# EAGLE design untitled (EAGLE 9.6.2)
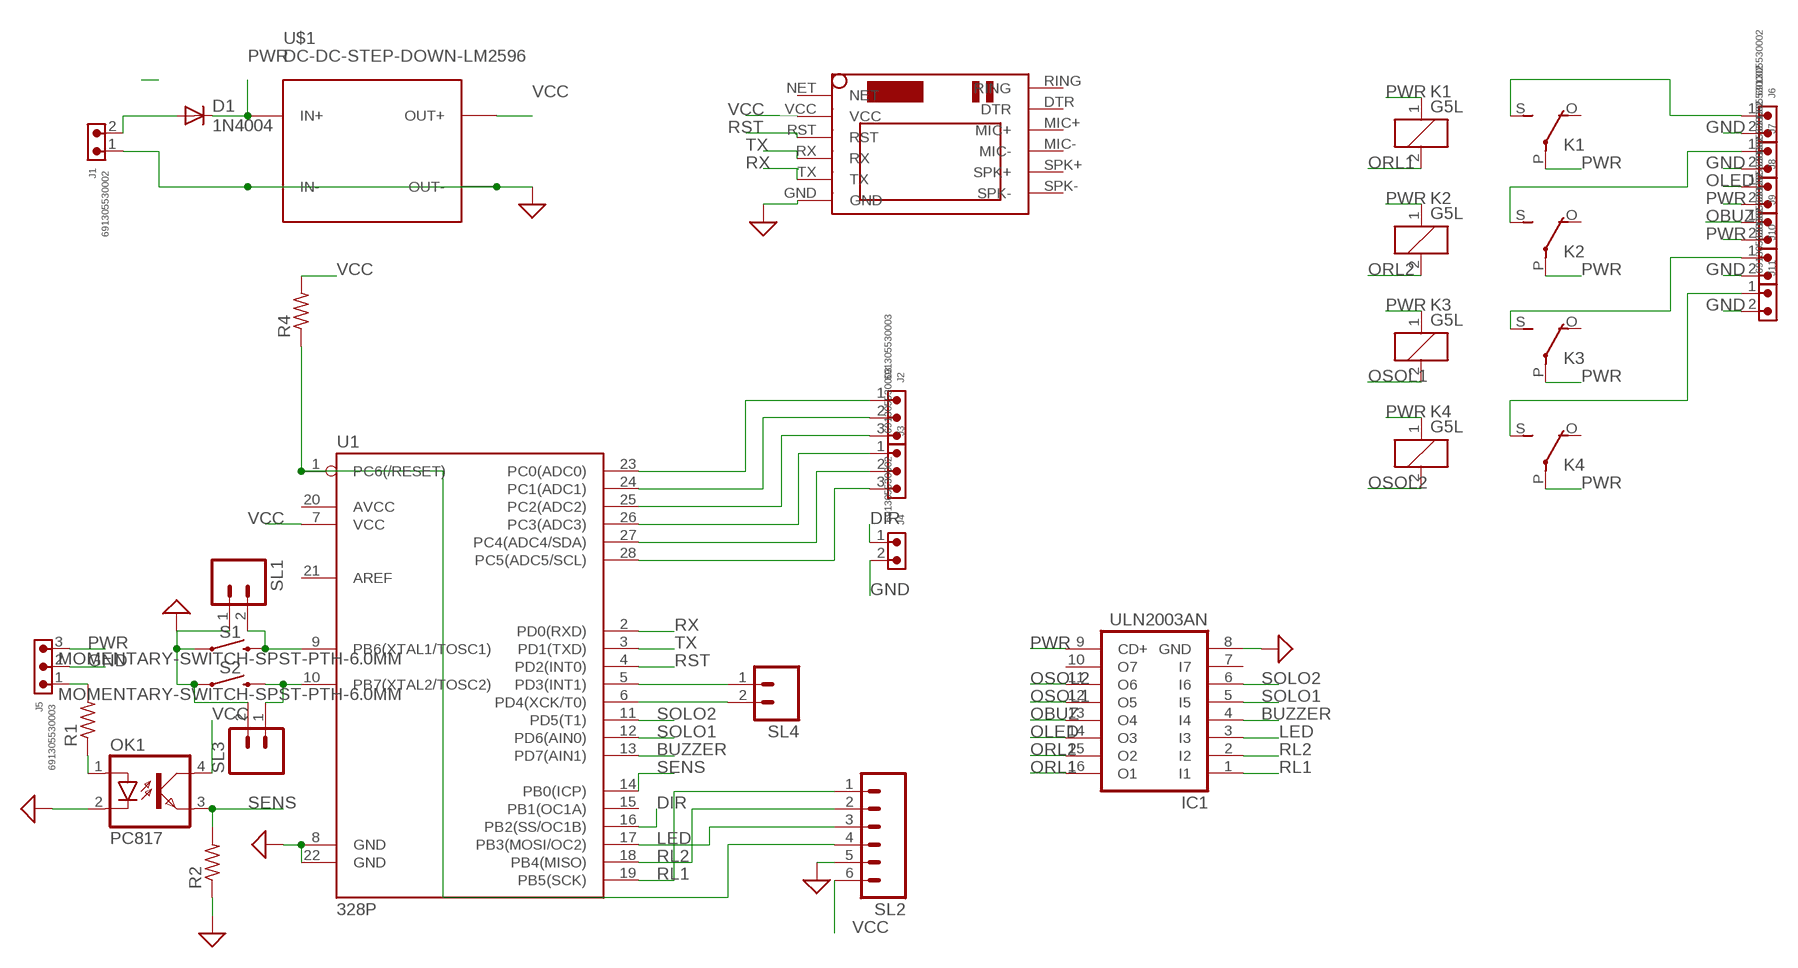
[diagram p0: schematic, sheet 1]

## Parts
D1  1N4004  [DO41-10]
IC1  ULN2003AN  [DIL16]
J1  691305530002  691305530002  [691305530002]
J2  691305530003  691305530003  [691305530003]
J3  691305530003  691305530003  [691305530003]
J4  691305530002  691305530002  [691305530002]
J5  691305530003  691305530003  [691305530003]
J6  691305530002  691305530002  [691305530002]
J7  691305530002  691305530002  [691305530002]
J8  691305530002  691305530002  [691305530002]
J9  691305530002  691305530002  [691305530002]
J10  691305530002  691305530002  [691305530002]
J11  691305530002  691305530002  [691305530002]
K1  G5L  [G5LE]
K2  G5L  [G5LE]
K3  G5L  [G5LE]
K4  G5L  [G5LE]
OK1  PC817  [DIL04]
R1  R-US_0207/10  [0207/10]
R2  R-US_0207/10  [0207/10]
R4  R-US_0207/10  [0207/10]
S1  MOMENTARY-SWITCH-SPST-PTH-6.0MM  [TACTILE_SWITCH_PTH_6.0MM]
S2  MOMENTARY-SWITCH-SPST-PTH-6.0MM  [TACTILE_SWITCH_PTH_6.0MM]
SL1  M02  [02P]
SL2  M06  [06P]
SL3  M02  [02P]
SL4  M02  [02P]
U1  328P  ATMEGA328P_PDIP  [DIP28]
U$1  DC-DC-STEP-DOWN-LM2596  [DC-DC-STEP-DOWN-LM2596]
U$2  SIM800LMODULE  [SIM800LMODULE]

## Nets
BUZZER: IC1.4(I4) U1.13(PD7(AIN1))
DIR: J4.1 U1.16(PB2(SS/OC1B))
GND: IC1.8(GND) J1.1 J4.2 J5.2 J6.2 J7.2 J10.2 J11.2 OK1.2(C) R2.1 S1.1 S2.1 SL1.1 SL2.5 SL3.2 U1.8(GND) U1.22(GND) U$1.IN- U$1.OUT- U$2.GND ; supply symbol labelled SUP
LED: IC1.3(I3) SL2.3 U1.17(PB3(MOSI/OC2))
N$1: J6.1 K1.S(2:S)
N$2: J2.1 U1.23(PC0(ADC0))
N$3: J2.2 U1.24(PC1(ADC1))
N$5: J7.1 K2.S(2:S)
N$6: J10.1 K3.S(2:S)
N$7: J2.3 U1.25(PC2(ADC2))
N$8: J3.1 U1.26(PC3(ADC3))
N$9: J3.2 U1.27(PC4(ADC4/SDA))
N$10: J3.3 U1.28(PC5(ADC5/SCL))
N$11: J5.1 R1.2
N$12: OK1.1(A) R1.1
N$13: S2.3 SL3.1 U1.10(PB7(XTAL2/TOSC2))
N$14: R4.1 SL2.4 U1.1(PC6(/RESET))
N$15: S1.3 SL1.2 U1.9(PB6(XTAL1/TOSC1))
N$16: J11.1 K4.S(2:S)
N$17: SL4.1 U1.5(PD3(INT1))
N$18: SL4.2 U1.6(PD4(XCK/T0))
OBUZ: IC1.13(O4) J9.1
OLED: IC1.14(O3) J8.1
ORL1: IC1.16(O1) K1.2
ORL2: IC1.15(O2) K2.2
OSOL1: IC1.12(O5) K3.2
OSOL2: IC1.11(O6) K4.2
PWR: D1.C IC1.9(CD+) J5.3 J8.2 J9.2 K1.1 K1.P(2:P) K2.1 K2.P(2:P) K3.1 K3.P(2:P) K4.1 K4.P(2:P) U$1.IN+
PWRIN: D1.A J1.2
RL1: IC1.1(I1) SL2.1 U1.19(PB5(SCK))
RL2: IC1.2(I2) SL2.2 U1.18(PB4(MISO))
RST: U1.4(PD2(INT0)) U$2.RST
RX: U1.2(PD0(RXD)) U$2.TX
SENS: OK1.3(EMIT) R2.2 U1.14(PB0(ICP))
SOLO1: IC1.5(I5) U1.12(PD6(AIN0))
SOLO2: IC1.6(I6) U1.11(PD5(T1))
TX: U1.3(PD1(TXD)) U$2.RX
VCC: OK1.4(COL) R4.2 SL2.6 U1.7(VCC) U$1.OUT+ U$2.VCC
Unconnected: IC1.7(I7) IC1.10(O7) K1.O(2:O) K2.O(2:O) K3.O(2:O) K4.O(2:O) U1.15(PB1(OC1A)) U1.20(AVCC) U1.21(AREF) U$2.DTR U$2.MIC+ U$2.MIC- U$2.NET U$2.RING U$2.SPK+ U$2.SPK-

## Library data of the parts
D1 = adafruit:1N4004: DIODE General purpose 1N400x type rectifier (With bigger pads) http://www.ladyada.net/library/pcb/eaglelibrary.html
IC1 = uln-udn:ULN2003A: DRIVER ARRAY
J1 J4 J6-J11 = Wurth_Connectors_WR-TBL Pluggable Connector:691305530002: WR-TBL Serie 3055 - 5,08 mm - PCB Header Vertical Entry with Plastic Latches KIND PROPERTIES Pitch 5.08 mm MATERIAL PROPERTIES Insulator Material PA66 Insulator Flammability Rating UL94 V-0 Insulator Color Green Terminal Material Copper Alloy Terminal Plating Tin-plated surface GENERAL INFORMATION Operating Temperature -40 up to +105 °C ELECTRICAL PROPERTIES IR UL 16 A Working Voltage [UL] 300 V (AC) Withstanding Voltage [UL] 2500 V (AC) Contact Resistance [UL] 20 mΩ CERTIFICATION UL Approval E315414 <https://www.we-online.com/catalog/media/o135349v209%20Family_WR-TBL3_6913055300xx.jpg> Details see: https://www.we-online.com/catalog/en/TBL_5_08_3055_6913055300XX/ Updated by Ella Wu 2019-12-30 2019(C) Wurth Elektronik; DATASHEET-URL: https://www.we-online.com/catalog/datasheet/691305530002.pdf; IR-UL: 16A; MOUNT: THT; PART-NUMBER: 691305530002; PINS: 2; PITCH: 5.08mm; TYPE: Vertical; WORKING-VOLTAGE-UL: 300V (AC)
J2 J3 J5 = Wurth_Connectors_WR-TBL Pluggable Connector:691305530003: WR-TBL Serie 3055 - 5,08 mm - PCB Header Vertical Entry with Plastic Latches KIND PROPERTIES Pitch 5.08 mm MATERIAL PROPERTIES Insulator Material PA66 Insulator Flammability Rating UL94 V-0 Insulator Color Green Terminal Material Copper Alloy Terminal Plating Tin-plated surface GENERAL INFORMATION Operating Temperature -40 up to +105 °C ELECTRICAL PROPERTIES IR UL 16 A Working Voltage [UL] 300 V (AC) Withstanding Voltage [UL] 2500 V (AC) Contact Resistance [UL] 20 mΩ CERTIFICATION UL Approval E315414 <https://www.we-online.com/catalog/media/o135349v209%20Family_WR-TBL3_6913055300xx.jpg> Details see: https://www.we-online.com/catalog/en/TBL_5_08_3055_6913055300XX/ Updated by Ella Wu 2019-12-30 2019(C) Wurth Elektronik; DATASHEET-URL: https://www.we-online.com/catalog/datasheet/691305530003.pdf; IR-UL: 16A; MOUNT: THT; PART-NUMBER: 691305530003; PINS: 3; PITCH: 5.08mm; TYPE: Vertical; WORKING-VOLTAGE-UL: 300V (AC)
K1-K4 = relay:G5L: RELAY 1 x switch, 10 A/120 V AC, 8 A/30 V ADC, Omron; OC_FARNELL: unknown; OC_NEWARK: unknown
OK1 = optocoupler:PC817: SHARP OPTO COUPLER; MPN: PC817X4J000F; OC_FARNELL: 9707727; OC_NEWARK: 97K7059
R1 = adafruit:R-US_: RESISTOR, American symbol
R2 R4 = BeagleBone_Black_Wireless:R-US_: RESISTOR, American symbol
S1 S2 = SparkFun-Switches:MOMENTARY-SWITCH-SPST: Momentary Switch (Pushbutton) - SPST Normally-open (NO) SPST momentary switches (buttons, pushbuttons). Variants PTH-12MM - 12mm square, through-hole Momentary Pushbutton Switch - 12mm Square <https://www.sparkfun.com/products/9190> (COM-09190) PTH-6.0MM, PTH-6.0MM-KIT - 6.0mm square, through-hole Mini Pushbutton Switch <https://www.sparkfun.com/products/97> (COM-00097) KIT package intended for soldering kit's - only one side of pads' copper is exposed. PTH-RIGHT-ANGLE-KIT - Right-angle, through-hole Right Angle Tactile Button <https://www.sparkfun.com/products/10791> - Used on SparkFun BigTime Watch Kit <https://www.sparkfun.com/products/11734> SMD-12MM - 12mm square, surface-mount Tactile Button - SMD (12mm) <https://www.sparkfun.com/products/12993> (COM-12993) Used on SparkFun PicoBoard <https://www.sparkfun.com/products/11888> SMD-4.5MM - 4.5mm Square Trackball Switch Used on SparkFun Blackberry Trackballer Breakout <https://www.sparkfun.com/products/13169> SMD-4.6MMX2.8MM - 4.60mm x 2.80mm, surface mount Used on SparkFun SAMD21 Mini Breakout <https://www.sparkfun.com/products/13664> SMD-5.2MM, SMD-5.2-REDUNDANT - 5.2mm square, surface-mount Mini Pushbutton Switch - SMD <https://www.sparkfun.com/products/8720> (COM-08720) Used on Arduino Pro Mini <https://www.sparkfun.com/products/11114> REDUNDANT package connects both switch circuits together SMD-6.0X3.5MM - 6.0 x 3.5mm, surface mount Momentary Reset Switch SMD <https://www.sparkfun.com/products/8229> (COM-08229) SMD-6.2MM-TALL - 6.2mm square, surface mount Tactile Button - SMD (6mm) <https://www.sparkfun.com/products/12992> Used on SparkFun Digital Sandbox <https://www.sparkfun.com/products/12651> SMD-RIGHT-ANGLE - Right-angle, surface mount Used on SparkFun Block for Intel® Edison - Arduino <https://www.sparkfun.com/products/13036>; PROD_ID: SWCH-08441; SF_SKU: COM-00097
SL1 SL3 SL4 = con-amp-quick:M02: AMP QUICK CONNECTOR; OC_FARNELL: unknown; OC_NEWARK: unknown
SL2 = con-amp-quick:M06: AMP QUICK CONNECTOR; OC_FARNELL: unknown; OC_NEWARK: unknown
U1 = SparkFun-IC-Microcontroller:ATMEGA328P_PDIP: Atmel 328P Through hole ATMEGA328P uC used in the Arduino 32kb flash, 1k EEPROM, 2k SRAM Datasheet <http://www.sparkfun.com/datasheets/Components/SMD/ATMega328.pdf> SparkFun Products Storefront component: AVR 28 Pin 20MHz 32K 6A/D - ATMega328P <https://www.sparkfun.com/products/9061> (COM-09061) SparkFun Simon Says - Through-Hole Soldering Kit <https://www.sparkfun.com/products/10547> (KIT-10547) SparkFun Learn to Solder - Simon Says <https://www.sparkfun.com/products/13708> (KIT-13708) SparkFun BigTime Watch Kit <https://www.sparkfun.com/products/11734> (KIT-11734) SparkFun ClockIt <https://www.sparkfun.com/products/10930> (KIT-10930) SparkFun Serial Enabled LCD Kit <https://www.sparkfun.com/products/10097> (LCD-10097) SparkFun Simon Tilts - Through Hole Soldering Kit <https://www.sparkfun.com/products/12634> (KIT-12634) SparkFun Frequency Counter Kit <https://www.sparkfun.com/products/10140> (KIT-10140) FabFM Radio Kit <https://www.sparkfun.com/products/11043> (KIT-11043) SparkFun Binary Blaster Kit <https://www.sparkfun.com/products/12037> (KIT-12037) SparkFun Metro-Gnome <https://www.sparkfun.com/products/9236> (KIT-09236) ATmega328 with Arduino Optiboot (Uno) <https://www.sparkfun.com/products/10524> (DEV-10524); PROD_ID: IC-09136
U$1 = diy-modules:DC-DC-STEP-DOWN-LM2596: DC/DC Step-Down Regulator based on LM2596-ADJ chip LM2596 datasheet available here: http://www.ti.com/lit/ds/symlink/lm2596.pdf Click here to find device on ebay.com <http://www.ebay.com/sch/lm2596+power+regulator>
U$2 = SIM800LMODULE:SIM800LMODULE: SIM800L Module

## Board
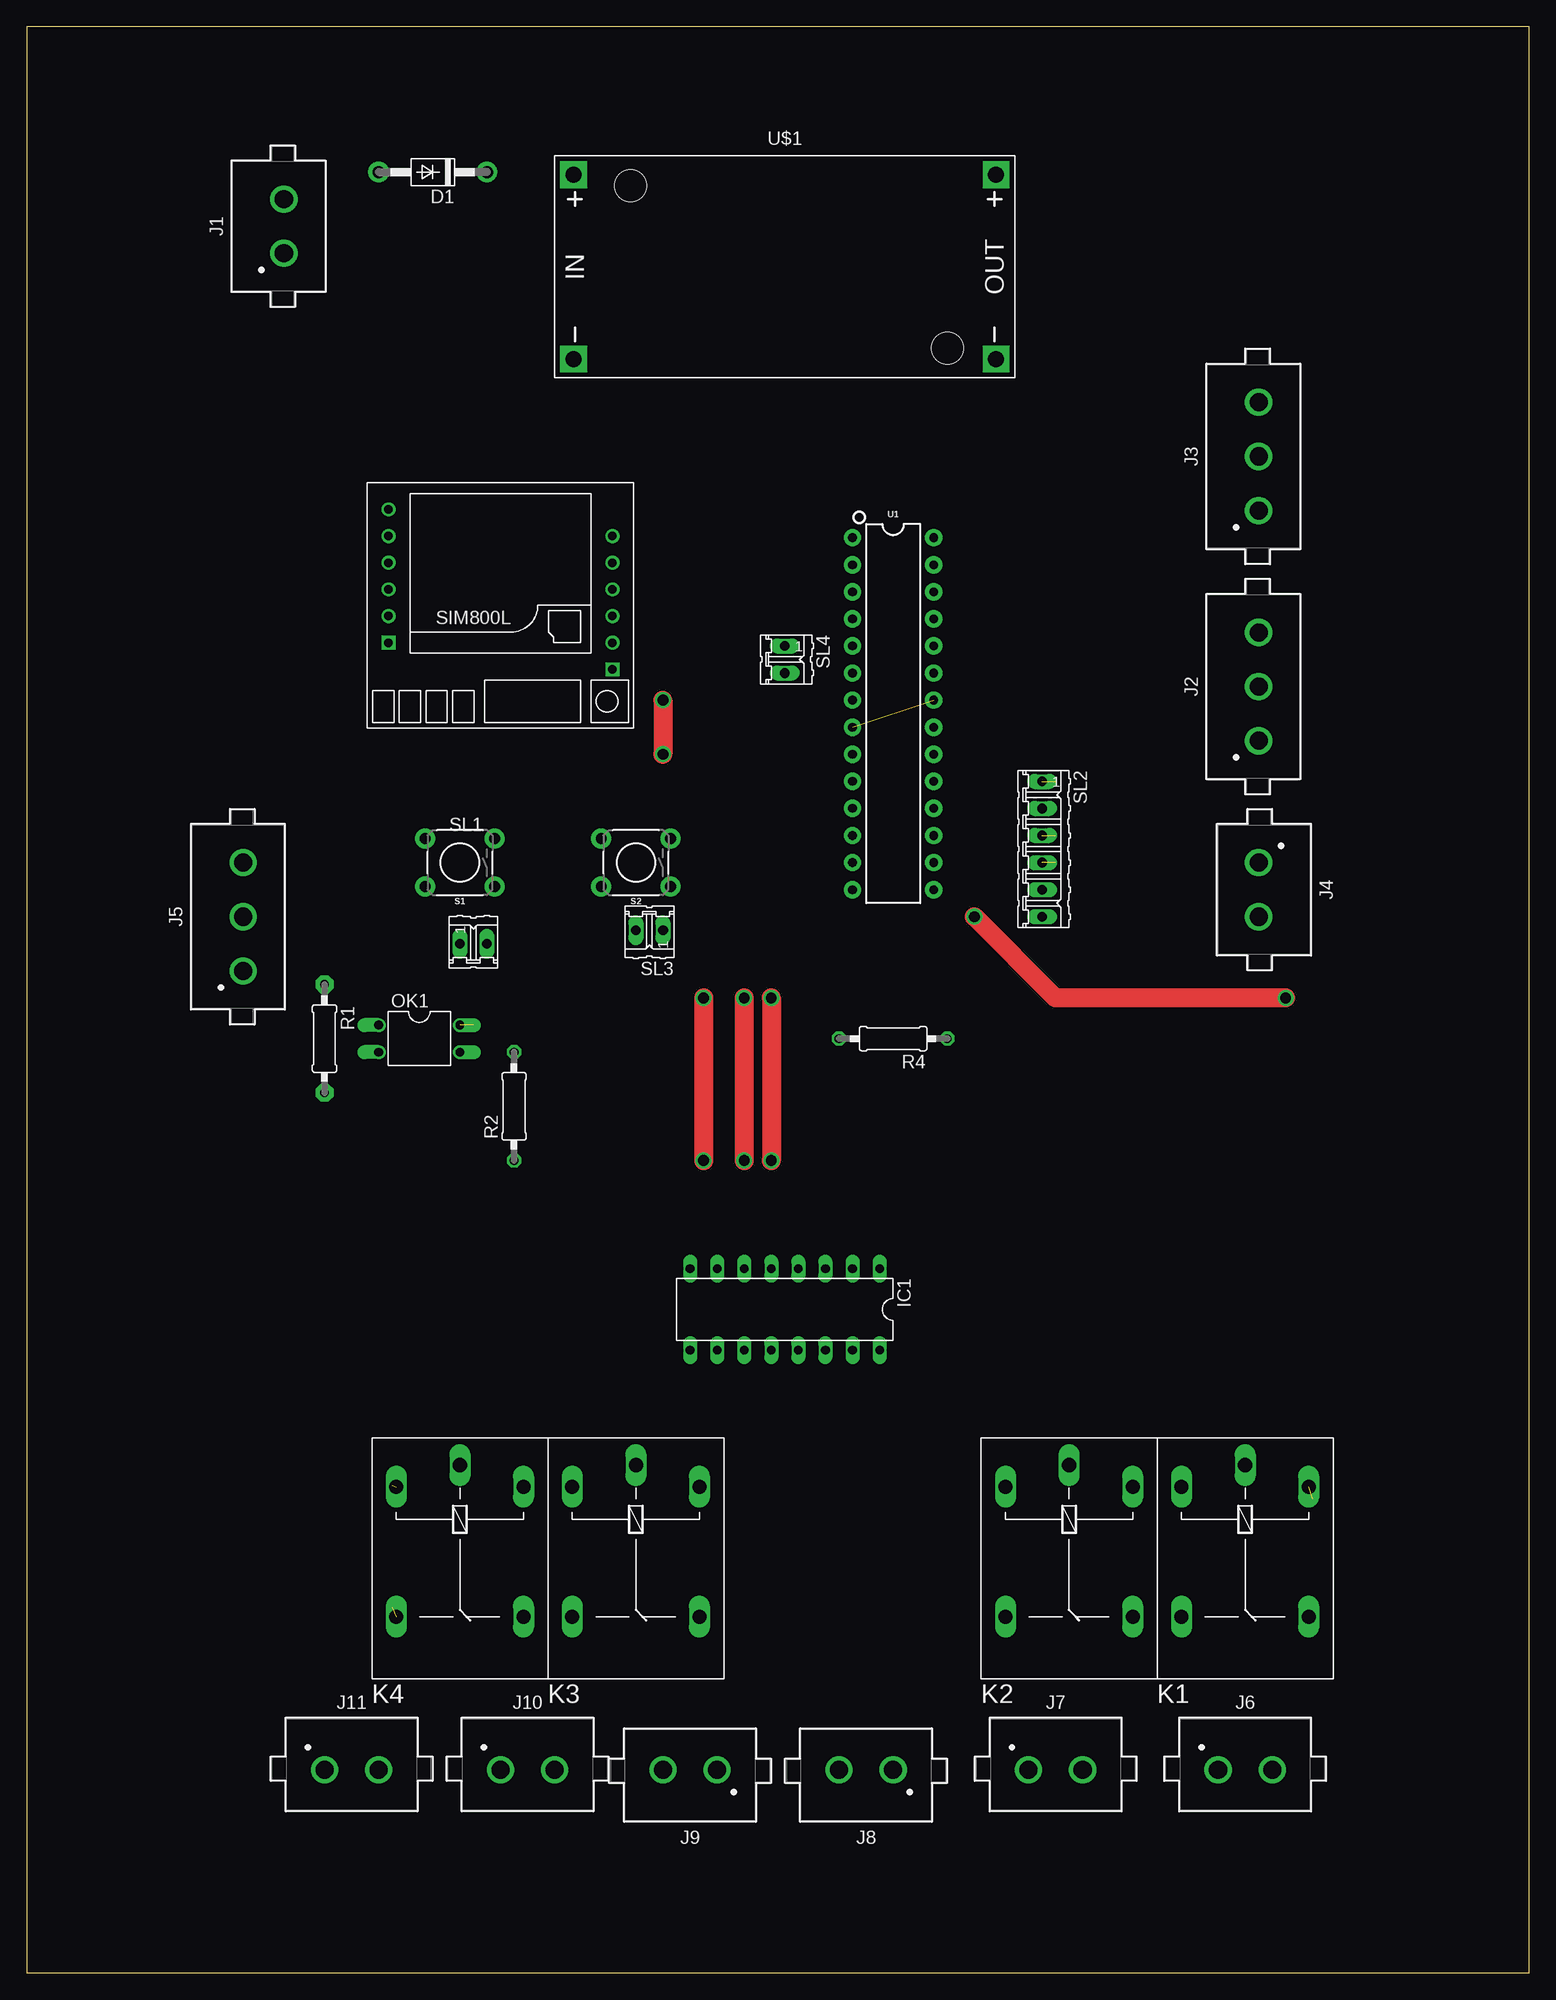
[diagram p1: board, top side]
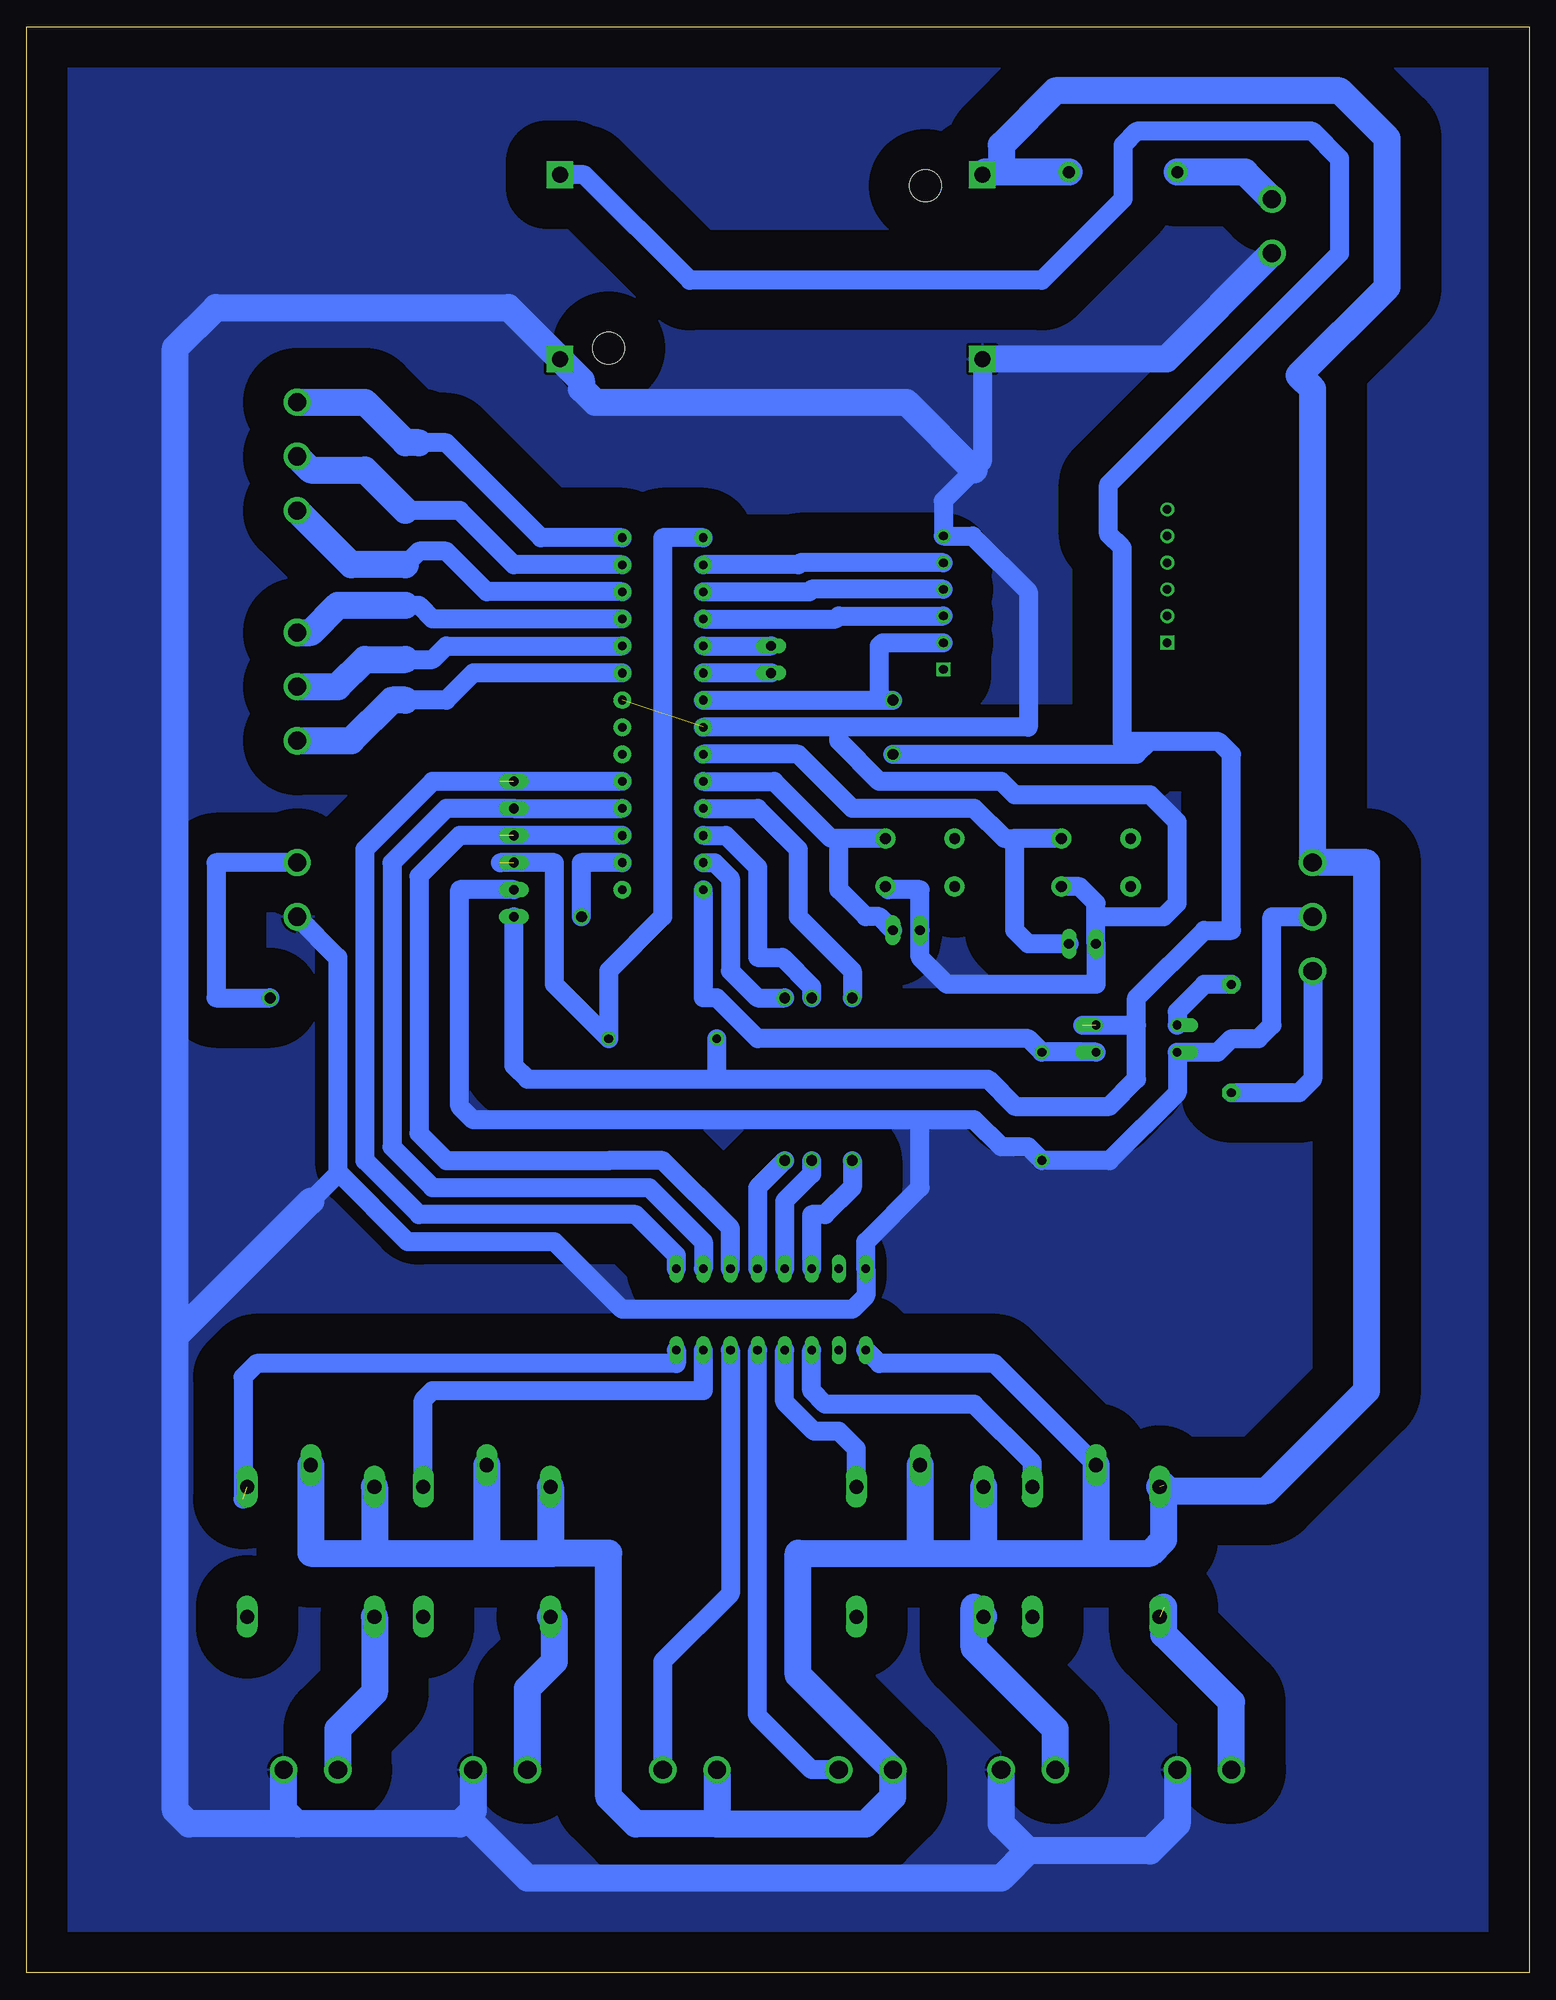
[diagram p2: board, bottom side, seen from below]

Size 140.95 x 182.55 mm. Coordinates in mm from the lower left corner, seen from the top.
Outline: 0,0 140.95,0 140.95,182.55 0,182.55 0,0
Copper layers (1*16): Top 0.035mm / dielectric 1.5mm / Bottom 0.035mm
Design rules "default *": minimum track width 6mil, minimum drill 0.35mm, track to track 30mil, track to pad 30mil, pad to pad 30mil, via to via 30mil, smd to smd 6mil, copper to edge 40mil, drill to drill 6mil, minimum pad ring 10mil, minimum via ring 8mil, stop-mask expansion 4mil, vias tented up to drill 0mil, thermal gap 10mil

### Footprints (pad centres in the part's own frame; a part is rotated, then mirrored left to right if it is on the bottom)
DO41-10 = drill 1.118 pad 1.93: A 5.08,0; C -5.08,0
DIL16 = drill 0.813 long: 1 -8.89,-3.81; 2 -6.35,-3.81; 3 -3.81,-3.81; 4 -1.27,-3.81; 5 1.27,-3.81; 6 3.81,-3.81; 7 6.35,-3.81; 8 8.89,-3.81; 9 8.89,3.81; 10 6.35,3.81; 11 3.81,3.81; 12 1.27,3.81; 13 -1.27,3.81; 14 -3.81,3.81; 15 -6.35,3.81; 16 -8.89,3.81
691305530002 = drill 1.7: 1 -2.54,0; 2 2.54,0
691305530003 = drill 1.7: 1 -5.08,0; 2 0,0; 3 5.08,0
G5LE = drill 1.321 long: 1 -7.493,-5.969; 2 -7.493,5.969; O 4.699,5.969; P -9.525,0; S 4.699,-5.969
DIL04 = drill 0.813 offset: 1 -1.27,-3.81; 2 1.27,-3.81; 3 1.27,3.81; 4 -1.27,3.81
0207/10 = drill 0.813 pad 1.676 octagon: 1 -5.08,0; 2 5.08,0
0207/10' = drill 0.813 octagon: 1 -5.08,0; 2 5.08,0
TACTILE_SWITCH_PTH_6.0MM = drill 1.016 pad 1.88: 1 -3.251,2.261; 2 3.251,2.261; 3 -3.251,-2.261; 4 3.251,-2.261
02P = drill 0.914 long: 1 -1.27,0; 2 1.27,0
06P = drill 0.914 long: 1 -6.35,0; 2 -3.81,0; 3 -1.27,0; 4 1.27,0; 5 3.81,0; 6 6.35,0
DIP28 = drill 0.813 pad 1.626: 1 -16.51,-3.81; 2 -13.97,-3.81; 3 -11.43,-3.81; 4 -8.89,-3.81; 5 -6.35,-3.81; 6 -3.81,-3.81; 7 -1.27,-3.81; 8 1.27,-3.81; 9 3.81,-3.81; 10 6.35,-3.81; 11 8.89,-3.81; 12 11.43,-3.81; 13 13.97,-3.81; 14 16.51,-3.81; 15 16.51,3.81; 16 13.97,3.81; 17 11.43,3.81; 18 8.89,3.81; 19 6.35,3.81; 20 3.81,3.81; 21 1.27,3.81; 22 -1.27,3.81; 23 -3.81,3.81; 24 -6.35,3.81; 25 -8.89,3.81; 26 -11.43,3.81; 27 -13.97,3.81; 28 -16.51,3.81
DC-DC-STEP-DOWN-LM2596 = drill 1.5 pad 2.5 square: IN+ -19.812,8.636; IN- -19.812,-8.636; OUT+ 19.812,8.636; OUT- 19.812,-8.636 | hole 3: -14.478,7.62; 15.24,-7.62
SIM800LMODULE = drill 0.8: DTR 10.5,1; GND -10.5,-6.5; MIC+ 10.5,-1.5; MIC- 10.5,-4; RST -10.5,1; RX -10.5,-1.5; SPK+ 10.5,-6.5; SPK- 10.5,-9; TX -10.5,-4; VCC -10.5,3.5 | drill 0.8 square: NET -10.5,6; RING 10.5,3.5

### Placement (x,y rotation side)
D1  38.1,168.91 180 top
IC1  71.12,62.23 180 top
J1  24.13,163.83 90 top
J2  115.57,120.65 90 top
J3  115.57,142.24 90 top
J4  115.57,101.6 270 top
J5  20.32,99.06 90 top
J6  114.3,19.05 0 top
J7  96.52,19.05 0 top
J8  78.74,19.05 180 top
J9  62.23,19.05 180 top
J10  46.99,19.05 0 top
J11  30.48,19.05 0 top
K1  114.3,38.1 270 top
K2  97.79,38.1 270 top
K3  57.15,38.1 270 top
K4  40.64,38.1 270 top
OK1  36.83,87.63 270 top
R1  27.94,87.63 270 top
R2  [0207/10']  45.72,81.28 90 top
R4  [0207/10']  81.28,87.63 180 top
S1  40.64,104.14 180 top
S2  57.15,104.14 180 top
SL1  41.91,96.52 0 top
SL2  95.25,105.41 270 top
SL3  58.42,97.79 180 top
SL4  71.12,123.19 270 top
U1  81.28,118.11 270 top
U$1  71.12,160.02 0 top
U$2  44.45,128.27 180 top

### Tracks (layer width: path | path; a pad name or v marks a point on that pad's centre or on a via)
BUZZER  (via drill 1)
  Top 1.778: v69.85,91.44 v69.85,76.2
  Bottom 1.778: U1.13 76.42,104.14 74.93,102.65 74.93,93.98 72.39,91.44 v69.85,91.44 | v69.85,76.2 72.39,73.66 IC1.4
DIR  (via drill 1)
  Top 1.778: v118.11,91.44 96.52,91.44 v88.9,99.06
  Bottom 1.778: U1.16 88.9,104.14 v88.9,99.06 | J4.1 123.19,104.14 123.19,91.44 v118.11,91.44
GND  (1 unrouted)
  Bottom 1.778: 64.77,116.84 46.99,116.84 46.99,129.54 52.22,134.77 U$2.GND 54.95,138.09 52.07,140.97 51.31,141.73 U$1.IN- | 64.77,116.84 U1.8 | SL2.5 100.33,101.6 100.33,81.28 99.06,80.01 57.15,80.01 | J5.2 24.13,99.06 24.13,88.9 25.4,87.63 27.94,87.63 29.21,86.36 OK1.2 33.02,82.55 39.37,76.2 R2.1 46.99,77.47 49.53,77.47 52.07,80.01 57.15,80.01 | 40.64,99.06 SL1.1 40.64,92.71 54.61,92.71 57.15,95.25 SL3.2 57.15,101.6 60.12,101.6 S2.1 | 40.64,99.06 40.64,100.33 42.19,101.88 S1.1 | 40.64,99.06 34.29,99.06 33.02,100.33 33.02,107.95 35.56,110.49 48.26,110.49 49.53,111.76 60.96,111.76 64.77,115.57 64.77,116.84 | 57.15,80.01 57.15,73.66 62.23,68.58 IC1.8 62.23,63.5 63.5,62.23 85.09,62.23 91.44,68.58 105.19,68.58 111.76,75.15 | J4.2 111.76,95.25 111.76,75.15 | 114.3,72.39 111.76,74.93 111.76,75.15
  Bottom 2.54: J1.1 34.04,151.38 U$1.IN- | 52.07,140.97 58.42,147.32 87.63,147.32 88.9,148.59 88.9,149.35 U$1.OUT- 95.76,156.21 123.19,156.21 127,152.4 127,59.69 | J11.2 33.02,13.97 35.56,11.43 46.99,11.43 | 46.99,11.43 49.53,13.97 J10.2 | J7.2 99.06,15.24 100.33,13.97 115.57,13.97 | 115.57,13.97 116.84,15.24 J6.2 | 46.99,11.43 49.53,8.89 93.98,8.89 99.06,13.97 | 115.57,13.97 125.73,13.97 127,15.24 127,59.69 | 114.3,72.39 127,59.69
  pour Bottom (isolate 3.81): 0,182.88 140.97,182.88 140.97,0 0,0
LED  (1 unrouted)
  Bottom 1.778: U1.17 96.52,106.68 | SL2.3 100.33,106.68 104.14,102.87 104.14,78.74 101.6,76.2 87.63,76.2 86.36,76.2 81.28,76.2 74.93,69.85 IC1.3
N$1
  Bottom 2.54: K1.S 108.33,26.29 111.76,22.86 J6.1
N$2
  Bottom 1.778: 105.41,119.38 101.6,119.38 99.06,121.92 U1.23
  Bottom 2.54: J2.1 110.49,115.57 106.68,119.38 105.41,119.38
N$3
  Bottom 1.778: 105.41,123.19 102.87,123.19 101.6,124.46 U1.24
  Bottom 2.54: J2.2 111.76,120.65 109.22,123.19 105.41,123.19
N$5
  Bottom 2.54: J7.1 93.98,26.67 91.44,29.21 91.44,33.02 K2.S
N$6
  Bottom 2.54: J10.1 44.45,22.86 52.07,30.48 52.07,34.29 K3.S
N$7
  Bottom 1.778: U1.25 102.87,127 104.14,128.27 105.41,128.27
  Bottom 2.54: J2.3 114.3,125.73 111.76,128.27 105.41,128.27
N$8
  Bottom 1.778: U1.26 97.79,129.54 101.6,133.35 104.14,133.35 105.41,132.08
  Bottom 2.54: 105.41,132.08 110.49,132.08 J3.1
N$9
  Bottom 1.778: 105.41,137.16 100.33,137.16 95.25,132.08 U1.27
  Bottom 2.54: J3.2 114.3,140.97 109.22,140.97 105.41,137.16
N$10
  Bottom 1.778: U1.28 92.71,134.62 101.6,143.51 104.14,143.51
  Bottom 2.54: 104.14,143.51 105.41,143.51 109.22,147.32 J3.3
N$11
  Bottom 1.778: J5.1 20.32,83.82 21.59,82.55 R1.2
N$12
  Bottom 1.778: R1.1 30.48,92.71 33.02,90.17 OK1.1
N$13
  Bottom 1.778: S2.3 64.21,106.4 | 64.21,106.4 65.48,106.4 70.84,111.76 U1.10 | 64.21,106.4 64.77,105.84 64.77,101.6 62.23,99.06 60.96,99.06 SL3.1
N$14  (1 unrouted)
  Bottom 1.778: U1.1 81.28,134.62 81.28,99.06 86.36,93.98 R4.1 91.44,92.71 91.44,104.14 96.52,104.14
N$15
  Bottom 1.778: S1.3 48.26,106.4 | 48.26,106.4 49.25,106.4 52.07,109.22 63.5,109.22 68.58,114.3 U1.9 | SL1.2 46.99,96.52 48.26,97.79 48.26,106.4
N$16  (1 unrouted)
  Bottom 2.54: J11.1 27.94,25.4 34.29,31.75 34.29,34.29
N$17
  Bottom 1.778: U1.5 SL4.1
N$18
  Bottom 1.778: SL4.2 U1.6
OBUZ
  Bottom 1.778: IC1.13 72.39,24.13 67.31,19.05 J9.1
OLED
  Bottom 1.778: J8.1 81.28,29.21 74.93,35.56 IC1.14
ORL1  (1 unrouted)
  Bottom 1.778: IC1.16 80.01,57.15 119.38,57.15 120.65,55.88 120.65,44.45
ORL2
  Bottom 1.778: K2.2 103.76,53.72 102.87,54.61 77.47,54.61 IC1.15
OSOL1
  Bottom 1.778: K3.2 63.12,49.15 64.77,50.8 67.09,50.8 69.85,53.56 IC1.12
OSOL2
  Bottom 1.778: K4.2 46.61,47.88 52.07,53.34 66.04,53.34 67.31,54.61 IC1.11
PWR  (1 unrouted)
  Bottom 1.778: K4.P 50.16,57.15 60.96,57.15 IC1.9
  Bottom 2.54: D1.C 49.53,168.91 | 49.53,168.91 51.05,168.91 U$1.IN+ | 49.53,168.91 49.53,171.45 44.45,176.53 17.78,176.53 13.33,172.09 13.33,158.12 21.59,149.86 20.32,148.59 J5.3 15.24,104.14 15.24,54.61 24.64,45.21 34.29,45.21 K4.1 | K1.P 114.3,39.37 107.95,39.37 | 107.95,39.37 97.79,39.37 | 97.79,39.37 91.44,39.37 | 57.15,39.37 50.8,39.37 | 50.8,39.37 40.64,39.37 | 40.64,39.37 35.56,39.37 34.29,40.64 34.29,45.72 | K4.P 40.64,39.37 | K3.1 51.18,39.75 50.8,39.37 | K3.P 57.15,39.37 | K2.1 91.82,39.75 91.44,39.37 | K2.P 97.79,39.37 | K1.1 108.33,39.75 107.95,39.37 | J8.2 76.2,13.97 | 76.2,13.97 62.23,13.97 59.69,16.51 J9.2 68.58,27.94 68.58,39.37 57.15,39.37 | 76.2,13.97 83.82,13.97 86.36,16.51 86.36,39.37 91.44,39.37
PWRIN
  Bottom 2.54: J1.2 26.67,168.91 D1.A
RL1  (1 unrouted)
  Bottom 1.778: U1.19 96.52,111.76 | SL2.1 102.87,111.76 109.22,105.41 109.22,76.2 104.14,71.12 83.82,71.12 80.01,67.31 IC1.1
RL2
  Bottom 1.778: SL2.2 U1.18 | SL2.2 96.52,109.22 | SL2.2 101.6,109.22 106.68,104.14 106.68,77.47 102.87,73.66 82.55,73.66 77.47,68.58 IC1.2
RST
  Bottom 1.778: U1.4 65.04,127 64.77,127.27 U$2.RST
RX
  Bottom 1.778: U$2.TX 68.39,132.27 68.58,132.08 U1.2
SENS
  Bottom 1.778: OK1.3 R2.2 46.99,87.63 72.39,87.63 76.2,91.44 77.47,91.44 U1.14
SOLO1  (via drill 1)
  Top 1.778: v67.31,91.44 v67.31,76.2
  Bottom 1.778: U1.12 75.37,106.68 72.39,103.7 72.39,95.25 70.07,95.25 67.31,92.49 v67.31,91.44 | v67.31,76.2 67.31,74.93 69.85,72.39 IC1.5
SOLO2  (via drill 1)
  Top 1.778: v63.5,91.44 v63.5,76.2
  Bottom 1.778: U1.11 72.39,109.22 68.58,105.41 68.58,99.06 63.5,93.98 v63.5,91.44 | v63.5,76.2 63.5,73.66 66.04,71.12 67.31,71.12 IC1.6
TX
  Bottom 1.778: U$2.RX 67.31,129.77 67.54,129.54 U1.3
VCC  (via drill 1)  (1 unrouted)
  Top 1.778: v59.69,119.38 v59.69,114.3
  Bottom 1.778: U1.7 60.96,119.38 | 60.96,119.38 60.96,124.46 60.65,124.77 U$2.VCC | SL2.6 95.25,85.09 93.98,83.82 76.2,83.82 | 76.2,83.82 R4.2 | 60.96,119.38 v59.69,119.38 | 76.2,83.82 50.8,83.82 48.26,81.28 39.37,81.28 36.83,83.82 36.83,88.9 | 41.91,88.9 36.83,88.9 | v59.69,114.3 36.83,114.3 35.64,115.49 | U$1.OUT+ 88.65,168.66 78.74,158.75 45.72,158.75 38.1,166.37 38.1,171.45 36.83,172.72 20.32,172.72 17.78,170.18 17.78,161.29 39.45,139.62 39.45,134.94 38.19,133.67 38.19,115.49 35.64,115.49 | 36.83,88.9 36.83,91.44 30.48,97.79 27.94,97.79 27.94,114.3 29.12,115.49 35.64,115.49